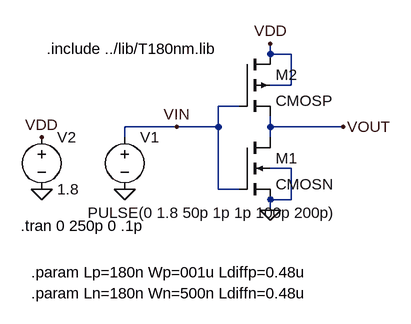
[diagram p0: schematic ejemplo.asc]
ejemplo.asc, the LTspice schematic file:
Version 4
SHEET 1 880 680
WIRE 256 16 256 0
WIRE 288 16 256 16
WIRE 288 64 288 16
WIRE 288 64 256 64
WIRE 208 96 176 96
WIRE 112 128 32 128
WIRE 176 128 176 96
WIRE 176 128 112 128
WIRE 256 128 256 112
WIRE 368 128 256 128
WIRE 32 144 32 128
WIRE 256 144 256 128
WIRE 288 192 256 192
WIRE 176 224 176 128
WIRE 208 224 176 224
WIRE 288 240 288 192
WIRE 288 240 256 240
WIRE 256 256 256 240
FLAG 256 256 0
FLAG 256 0 VDD
FLAG 368 128 VOUT
FLAG 112 128 VIN
FLAG -96 224 0
FLAG 32 224 0
FLAG -96 144 VDD
SYMBOL nmos4 208 144 R0
SYMATTR InstName M1
SYMATTR Value CMOSN
SYMATTR Value2 l={Ln} w={Wn} ad={Ldiffn*Wn} as={Ldiffn*Wn} pd={2*Ldiffn+Wn} ps={2*Ldiffn+Wn}
SYMBOL pmos4 208 16 R0
SYMATTR InstName M2
SYMATTR Value CMOSP
SYMATTR Value2 l={Lp} w={Wp} ad={Ldiffp*Wp} as={Ldiffp*Wp} pd={2*Ldiffp+Wp} ps={2*Ldiffp+Wp}
SYMBOL voltage 32 128 R0
WINDOW 3 -57 132 Left 2
WINDOW 123 0 0 Left 2
WINDOW 39 0 0 Left 2
SYMATTR Value PULSE(0 1.8 50p 1p 1p 100p 200p)
SYMATTR InstName V1
SYMBOL voltage -96 128 R0
WINDOW 123 0 0 Left 2
WINDOW 39 0 0 Left 2
SYMATTR InstName V2
SYMATTR Value 1.8
TEXT -88 8 Left 2 !.include ../lib/T180nm.lib
TEXT -128 280 Left 2 !.tran 0 250p 0 .1p
TEXT -112 352 Left 2 !.param Lp=180n Wp=001u Ldiffp=0.48u
TEXT -112 384 Left 2 !.param Ln=180n Wn=500n Ldiffn=0.48u

The netlist it stands for:
* ejemplo.asc
M1 VOUT VIN 0 0 CMOSN l={Ln} w={Wn} ad={Ldiffn*Wn} as={Ldiffn*Wn} pd={2*Ldiffn+Wn} ps={2*Ldiffn+Wn}
M2 VDD VIN VOUT VDD CMOSP l={Lp} w={Wp} ad={Ldiffp*Wp} as={Ldiffp*Wp} pd={2*Ldiffp+Wp} ps={2*Ldiffp+Wp}
V1 VIN 0 PULSE(0 1.8 50p 1p 1p 100p 200p)
V2 VDD 0 1.8
.model NMOS NMOS
.model PMOS PMOS
.lib standard.mos
.include ../lib/T180nm.lib
.tran 0 250p 0 .1p
.param Lp=180n Wp=001u Ldiffp=0.48u
.param Ln=180n Wn=500n Ldiffn=0.48u
.backanno
.end